# Altium project PCB_PAIND_DeIcing.PrjPcb
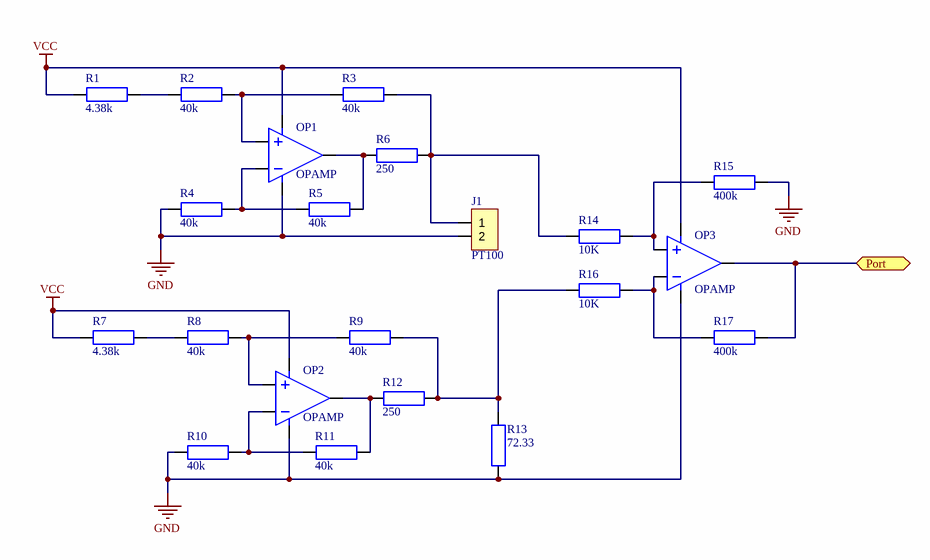
[diagram p0: PCB_DeIcing.SchDoc]
2 sheets, 24 parts. Net scope: flat (ports and power ports of the same name join across sheets).
Sheets:
  PCB_DeIcing.SchDoc
  Shema_Leistungsendstufe.SchDoc

## Sheet PCB_DeIcing.SchDoc: PT100_Schaltung
size A4; Date: 14.11.2018; Author: Theo Zwahlen; DrawnBy: Theo Zwahlen; Engineer: Theo Zwahlen; Organization: HSLU T&A; Address1: Abteilung Elektrotechnik; Address2: Technikumsstrasse 21; Address3: CH-6048 Horw; Revision: 0; Projektname: Rotorblattenteisung; pcbDesigner: Theo Zwahlen; ProjectName: Rotorblattenteisung

### Parts
(Parts that share a designator on the sheet are numbered #1, #2 ... from top to bottom, then left to right.)
J1  PT100
OP1  OPAMP
OP2  OPAMP
OP3  OPAMP
R1#1  4.38k
R2#1  40k
R3  40k
R4  40k
R5  40k
R6  250
R7  4.38k
R8  40k
R9  40k
R10  40k
R11  40k
R12  250
R13  72.33
R14  10K
R15  400k
R16  10K
R17  400k

### Ports
Port

### Nets
GND: J1.2 OP1.5 OP2.5 OP3.5 R4.1 R10.1 R13.1 R15.2
VCC: OP1.4 OP2.4 OP3.4 R1#1.1 R7.1
NetJ1_1: J1.1 R3.2 R6.2 R14.1
NetOP1_1: OP1.1 R2#1.2 R3.1
NetOP1_2: OP1.2 R4.2 R5.1
NetOP1_3: OP1.3 R5.2 R6.1
NetOP2_1: OP2.1 R8.2 R9.1
NetOP2_2: OP2.2 R10.2 R11.1
NetOP2_3: OP2.3 R11.2 R12.1
NetOP3_1: OP3.1 R14.2 R15.1
NetOP3_2: OP3.2 R16.2 R17.1
NetOP3_3: OP3.3 R17.2 ; port Port
NetR1#1_2: R1#1.2 R2#1.1
NetR7_2: R7.2 R8.1
NetR9_2: R9.2 R12.2 R13.2 R16.1

### Notes on the sheet
- Project:
- Drawn by:
- Size:
- Sheet
- A4
- Rev.:
- of
- Date:
- File:

### Library data of the parts
J1 = CON2
R1#1 R2#1 R3-R17 = R?: Normaler Widerstand

## Sheet Shema_Leistungsendstufe.SchDoc
size A3; Organization: HSLU T&A; Address1: Abteilung Elektrotechnik; Address2: Technikumsstrasse 21; Address3: CH-6048 Horw
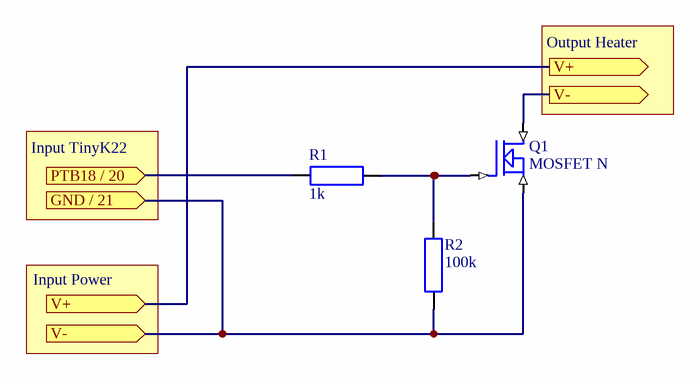
[diagram p1: Shema_Leistungsendstufe.SchDoc]

### Parts
(Parts that share a designator on the sheet are numbered #1, #2 ... from top to bottom, then left to right.)
Q1  MOSFET N
R1#2  1k
R2#2  100k

### Ports
GND / 21 (in), PTB18 / 20 (in), V+ (in), V+ (out), V- (in), V- (out)

### Nets
NetQ1_DRAIN: Q1.DRAIN Q1.SOURCE R2#2.2 ; port GND / 21, port V-
NetQ1_GATE: Q1.GATE R1#2.2 R2#2.1
NetR1#2_1: R1#2.1 ; port PTB18 / 20

### Notes on the sheet
- Output Heater
- Input TinyK22
- Input Power
- Project:
- Drawn by:
- Size:
- Sheet
- A3
- Rev.:
- of
- Date:
- File:

### Library data of the parts
R1#2 R2#2 = R?: Normaler Widerstand